# Altium project 175-00036, rev1, Super Sniffer.PrjPCB
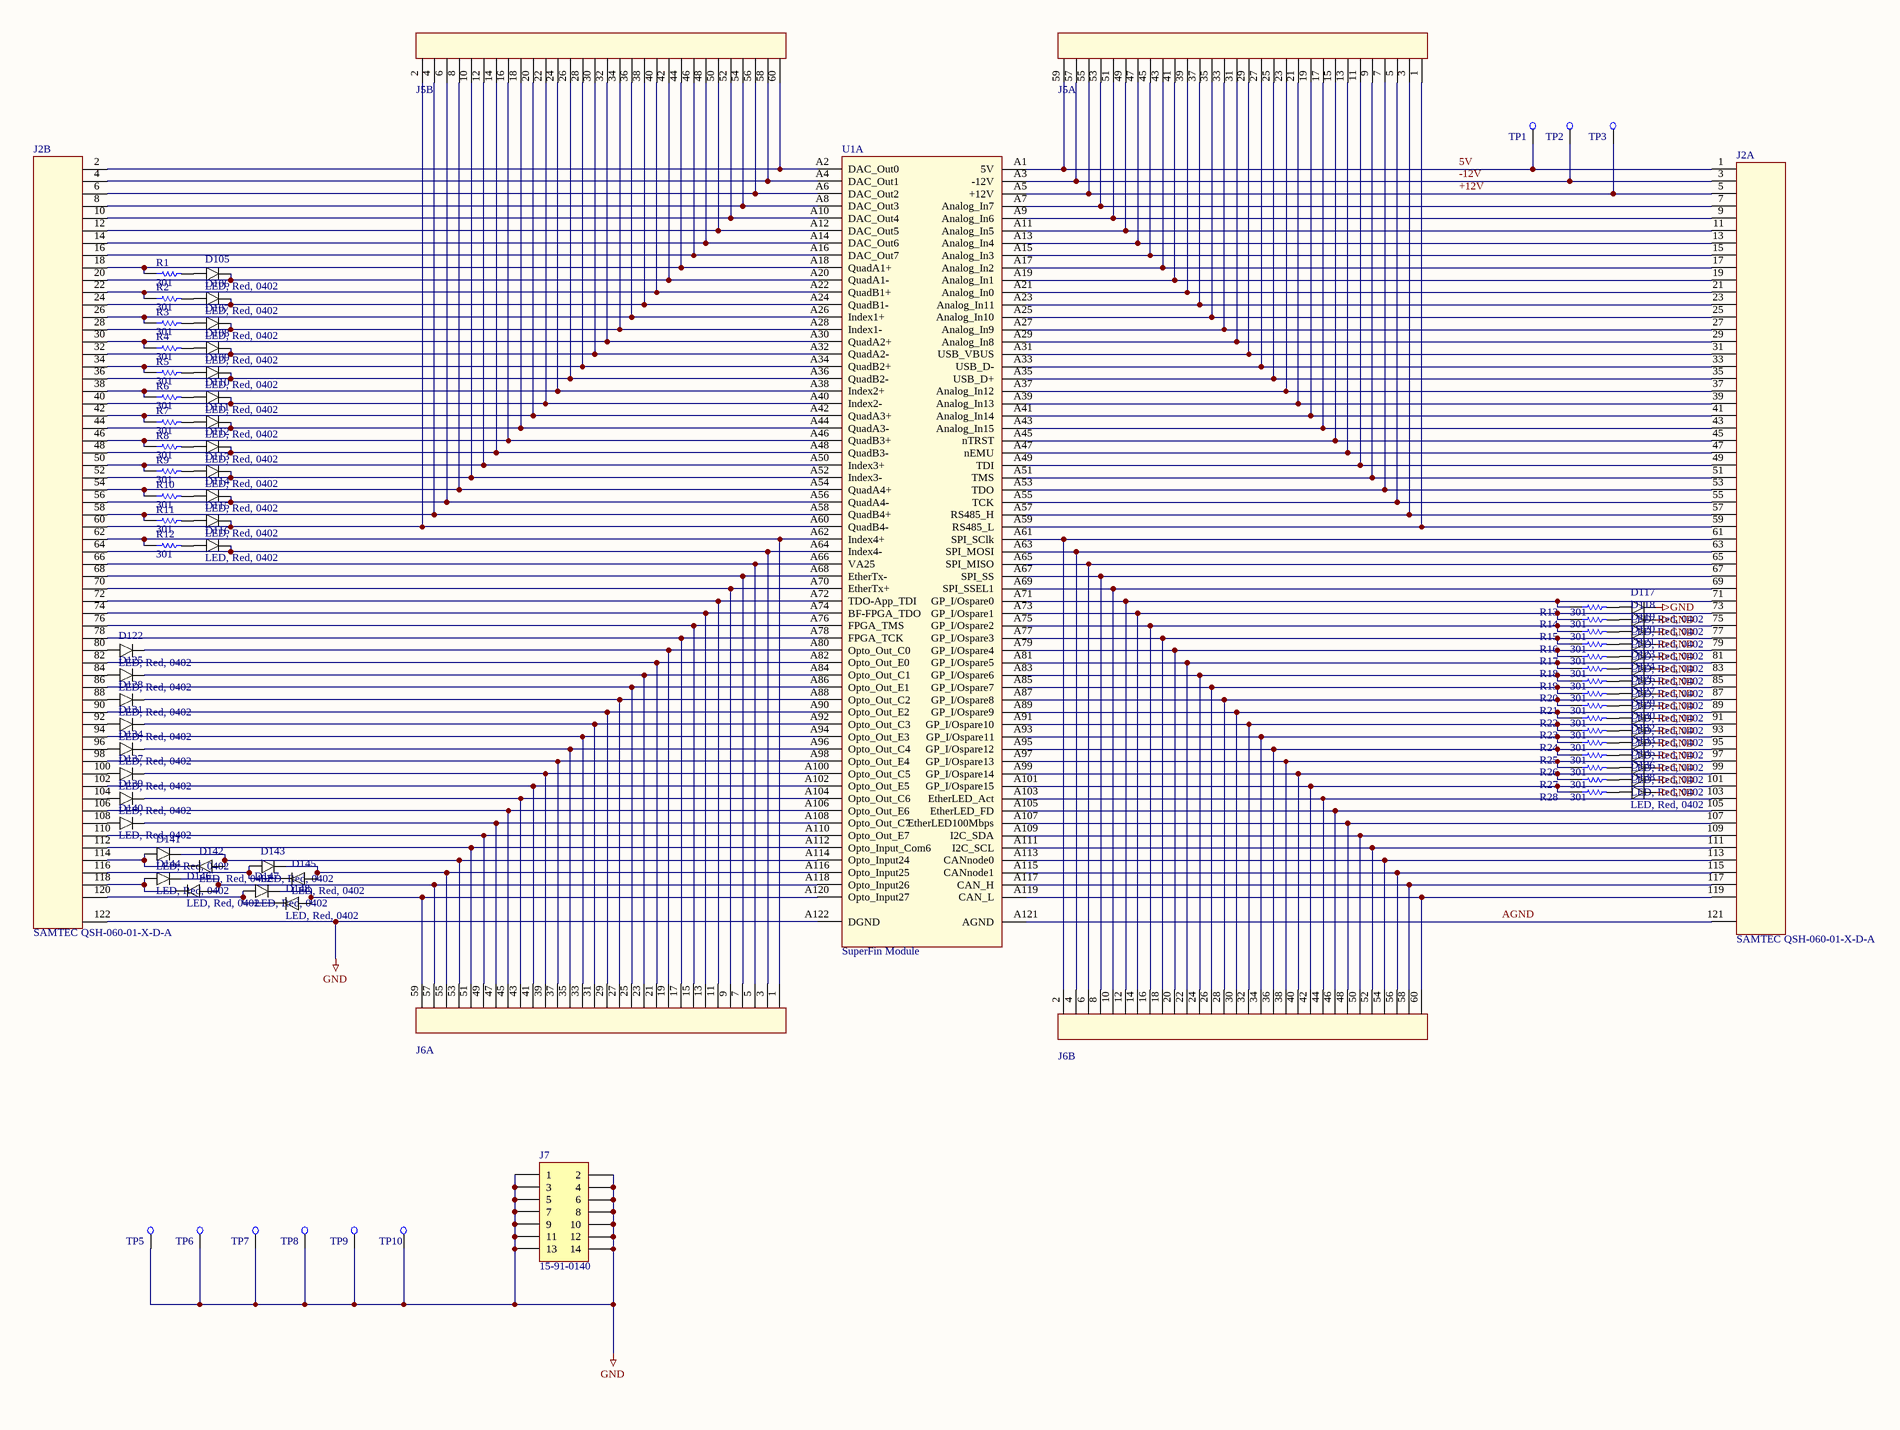
[diagram p0: 780-00040, Rev1, Pg1, Super Sniffer.SchDoc, left]
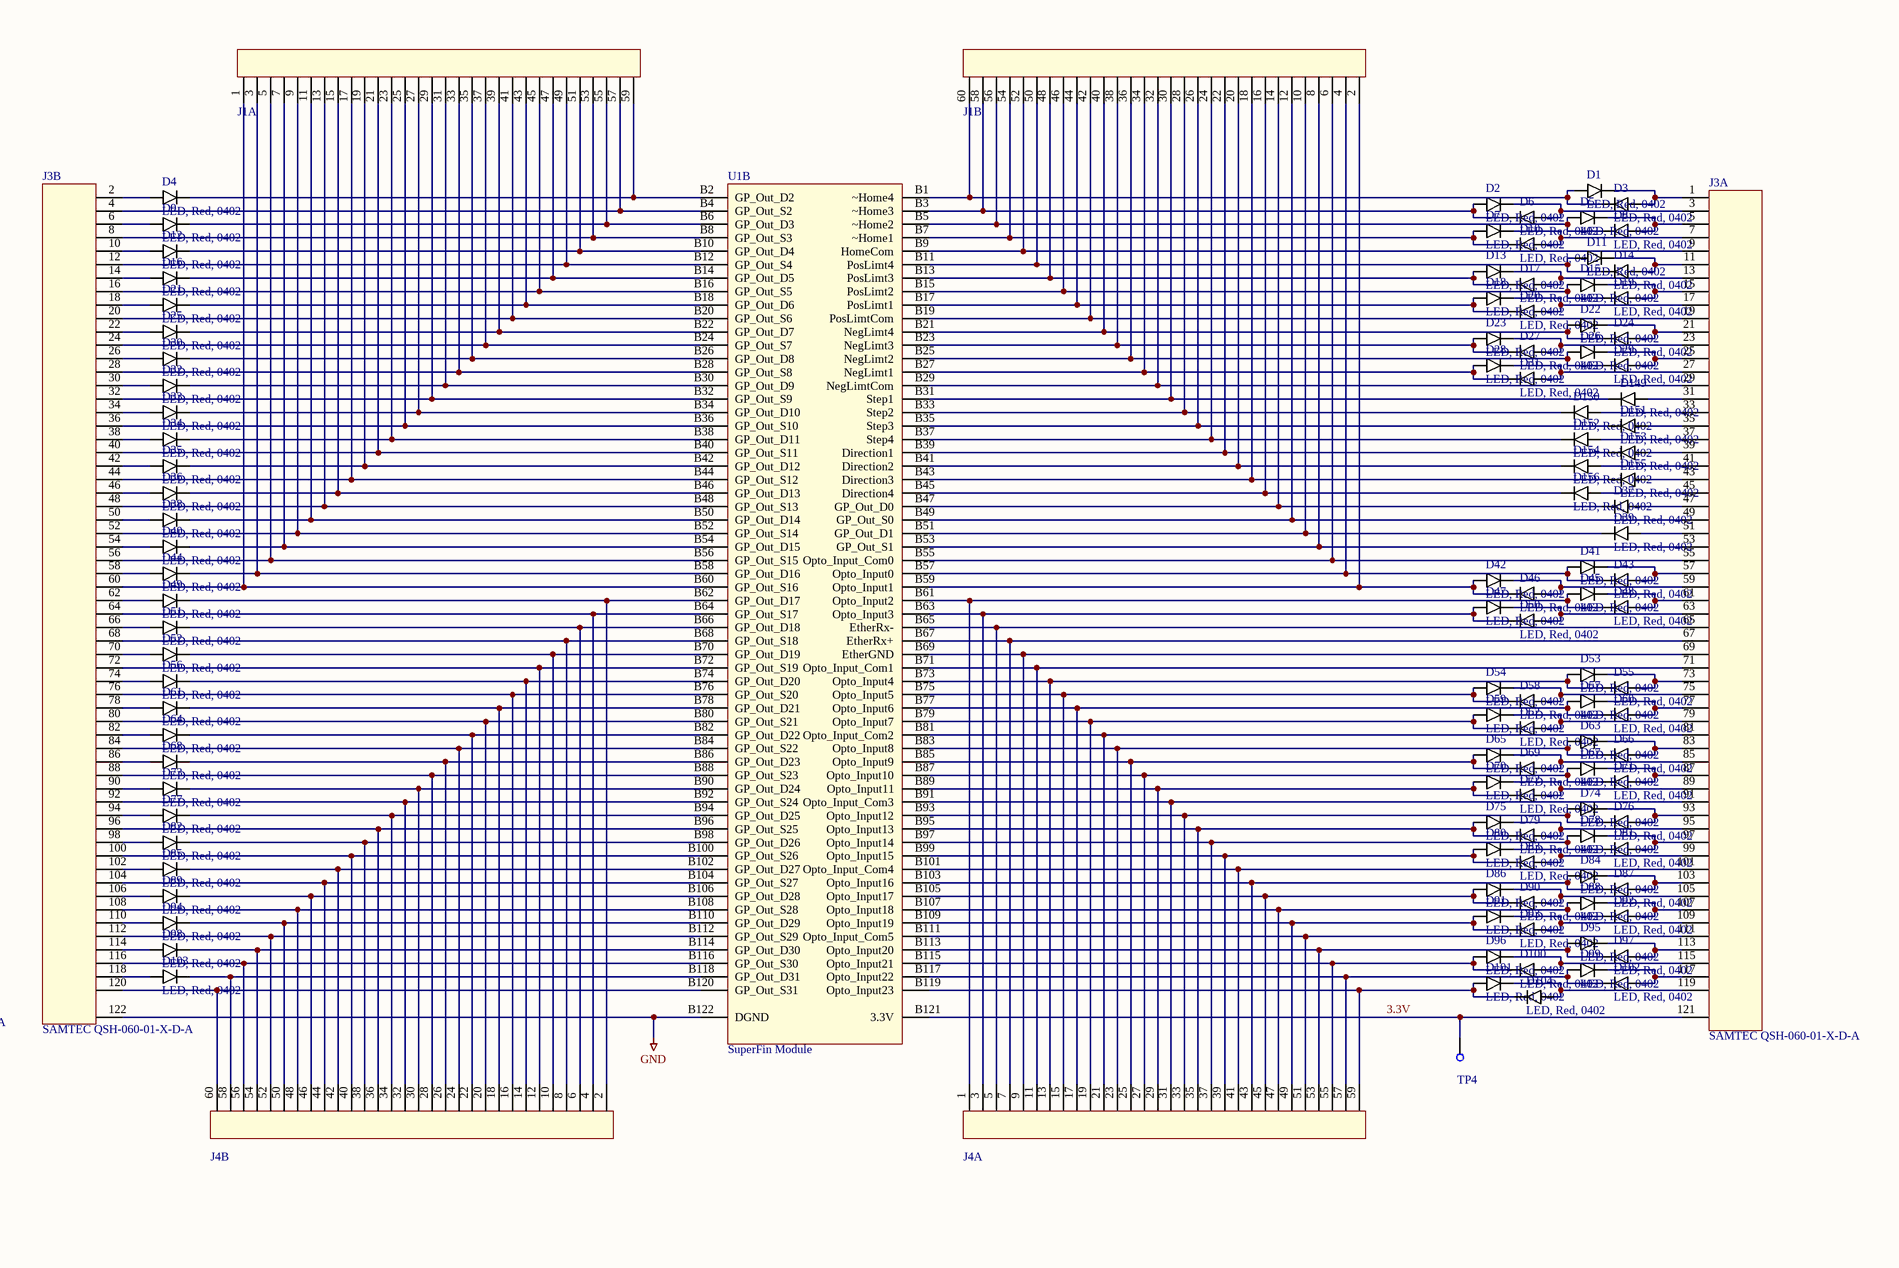
[diagram p1: 780-00040, Rev1, Pg1, Super Sniffer.SchDoc, right]
2 sheets, 209 parts. Net scope: global (net labels, ports and power ports of the same name join across sheets).
Board file: 175-00036, rev1, Super Sniffer.PcbDoc
Sheets:
  780-00040, Rev1, Pg1, Super Sniffer.SchDoc
  Sheet1.SchDoc

## Sheet 780-00040, Rev1, Pg1, Super Sniffer.SchDoc
size D; PageSetup: Record=PageOptions|CenterHorizontal=True|CenterVertical=True|PrintScale=0.51|XCorrection=1.00|YCorrection=1.00|PrintKind=0|BorderSize=5000000|LeftOffset=0|BottomOffset=0|Orientation=2|PaperLength=1000|PaperWidth=1000|Scale=100|PaperSource=7|PrintQuality=-4|MediaType=1|DitherType=10|PaperKind=Tabloid 11 x 17in|PrintScaleMode=1

### Parts
D1  value LED, Red, 0402  [LED SMD 0402]  (hidden comment: LED SMD 0402)
D2  value LED, Red, 0402  [LED SMD 0402]  (hidden comment: LED SMD 0402)
D3  value LED, Red, 0402  [LED SMD 0402]  (hidden comment: LED SMD 0402)
D4  value LED, Red, 0402  [LED SMD 0402]  (hidden comment: LED SMD 0402)
D5  value LED, Red, 0402  [LED SMD 0402]  (hidden comment: LED SMD 0402)
D6  value LED, Red, 0402  [LED SMD 0402]  (hidden comment: LED SMD 0402)
D7  value LED, Red, 0402  [LED SMD 0402]  (hidden comment: LED SMD 0402)
D8  value LED, Red, 0402  [LED SMD 0402]  (hidden comment: LED SMD 0402)
D9  value LED, Red, 0402  [LED SMD 0402]  (hidden comment: LED SMD 0402)
D10  value LED, Red, 0402  [LED SMD 0402]  (hidden comment: LED SMD 0402)
D11  value LED, Red, 0402  [LED SMD 0402]  (hidden comment: LED SMD 0402)
D12  value LED, Red, 0402  [LED SMD 0402]  (hidden comment: LED SMD 0402)
D13  value LED, Red, 0402  [LED SMD 0402]  (hidden comment: LED SMD 0402)
D14  value LED, Red, 0402  [LED SMD 0402]  (hidden comment: LED SMD 0402)
D15  value LED, Red, 0402  [LED SMD 0402]  (hidden comment: LED SMD 0402)
D16  value LED, Red, 0402  [LED SMD 0402]  (hidden comment: LED SMD 0402)
D17  value LED, Red, 0402  [LED SMD 0402]  (hidden comment: LED SMD 0402)
D18  value LED, Red, 0402  [LED SMD 0402]  (hidden comment: LED SMD 0402)
D19  value LED, Red, 0402  [LED SMD 0402]  (hidden comment: LED SMD 0402)
D20  value LED, Red, 0402  [LED SMD 0402]  (hidden comment: LED SMD 0402)
D21  value LED, Red, 0402  [LED SMD 0402]  (hidden comment: LED SMD 0402)
D22  value LED, Red, 0402  [LED SMD 0402]  (hidden comment: LED SMD 0402)
D23  value LED, Red, 0402  [LED SMD 0402]  (hidden comment: LED SMD 0402)
D24  value LED, Red, 0402  [LED SMD 0402]  (hidden comment: LED SMD 0402)
D25  value LED, Red, 0402  [LED SMD 0402]  (hidden comment: LED SMD 0402)
D26  value LED, Red, 0402  [LED SMD 0402]  (hidden comment: LED SMD 0402)
D27  value LED, Red, 0402  [LED SMD 0402]  (hidden comment: LED SMD 0402)
D28  value LED, Red, 0402  [LED SMD 0402]  (hidden comment: LED SMD 0402)
D29  value LED, Red, 0402  [LED SMD 0402]  (hidden comment: LED SMD 0402)
D30  value LED, Red, 0402  [LED SMD 0402]  (hidden comment: LED SMD 0402)
D31  value LED, Red, 0402  [LED SMD 0402]  (hidden comment: LED SMD 0402)
D32  value LED, Red, 0402  [LED SMD 0402]  (hidden comment: LED SMD 0402)
D33  value LED, Red, 0402  [LED SMD 0402]  (hidden comment: LED SMD 0402)
D34  value LED, Red, 0402  [LED SMD 0402]  (hidden comment: LED SMD 0402)
D35  value LED, Red, 0402  [LED SMD 0402]  (hidden comment: LED SMD 0402)
D36  value LED, Red, 0402  [LED SMD 0402]  (hidden comment: LED SMD 0402)
D37  value LED, Red, 0402  [LED SMD 0402]  (hidden comment: LED SMD 0402)
D38  value LED, Red, 0402  [LED SMD 0402]  (hidden comment: LED SMD 0402)
D39  value LED, Red, 0402  [LED SMD 0402]  (hidden comment: LED SMD 0402)
D40  value LED, Red, 0402  [LED SMD 0402]  (hidden comment: LED SMD 0402)
D41  value LED, Red, 0402  [LED SMD 0402]  (hidden comment: LED SMD 0402)
D42  value LED, Red, 0402  [LED SMD 0402]  (hidden comment: LED SMD 0402)
D43  value LED, Red, 0402  [LED SMD 0402]  (hidden comment: LED SMD 0402)
D44  value LED, Red, 0402  [LED SMD 0402]  (hidden comment: LED SMD 0402)
D45  value LED, Red, 0402  [LED SMD 0402]  (hidden comment: LED SMD 0402)
D46  value LED, Red, 0402  [LED SMD 0402]  (hidden comment: LED SMD 0402)
D47  value LED, Red, 0402  [LED SMD 0402]  (hidden comment: LED SMD 0402)
D48  value LED, Red, 0402  [LED SMD 0402]  (hidden comment: LED SMD 0402)
D49  value LED, Red, 0402  [LED SMD 0402]  (hidden comment: LED SMD 0402)
D50  value LED, Red, 0402  [LED SMD 0402]  (hidden comment: LED SMD 0402)
D51  value LED, Red, 0402  [LED SMD 0402]  (hidden comment: LED SMD 0402)
D52  value LED, Red, 0402  [LED SMD 0402]  (hidden comment: LED SMD 0402)
D53  value LED, Red, 0402  [LED SMD 0402]  (hidden comment: LED SMD 0402)
D54  value LED, Red, 0402  [LED SMD 0402]  (hidden comment: LED SMD 0402)
D55  value LED, Red, 0402  [LED SMD 0402]  (hidden comment: LED SMD 0402)
D56  value LED, Red, 0402  [LED SMD 0402]  (hidden comment: LED SMD 0402)
D57  value LED, Red, 0402  [LED SMD 0402]  (hidden comment: LED SMD 0402)
D58  value LED, Red, 0402  [LED SMD 0402]  (hidden comment: LED SMD 0402)
D59  value LED, Red, 0402  [LED SMD 0402]  (hidden comment: LED SMD 0402)
D60  value LED, Red, 0402  [LED SMD 0402]  (hidden comment: LED SMD 0402)
D61  value LED, Red, 0402  [LED SMD 0402]  (hidden comment: LED SMD 0402)
D62  value LED, Red, 0402  [LED SMD 0402]  (hidden comment: LED SMD 0402)
D63  value LED, Red, 0402  [LED SMD 0402]  (hidden comment: LED SMD 0402)
D64  value LED, Red, 0402  [LED SMD 0402]  (hidden comment: LED SMD 0402)
D65  value LED, Red, 0402  [LED SMD 0402]  (hidden comment: LED SMD 0402)
D66  value LED, Red, 0402  [LED SMD 0402]  (hidden comment: LED SMD 0402)
D67  value LED, Red, 0402  [LED SMD 0402]  (hidden comment: LED SMD 0402)
D68  value LED, Red, 0402  [LED SMD 0402]  (hidden comment: LED SMD 0402)
D69  value LED, Red, 0402  [LED SMD 0402]  (hidden comment: LED SMD 0402)
D70  value LED, Red, 0402  [LED SMD 0402]  (hidden comment: LED SMD 0402)
D71  value LED, Red, 0402  [LED SMD 0402]  (hidden comment: LED SMD 0402)
D72  value LED, Red, 0402  [LED SMD 0402]  (hidden comment: LED SMD 0402)
D73  value LED, Red, 0402  [LED SMD 0402]  (hidden comment: LED SMD 0402)
D74  value LED, Red, 0402  [LED SMD 0402]  (hidden comment: LED SMD 0402)
D75  value LED, Red, 0402  [LED SMD 0402]  (hidden comment: LED SMD 0402)
D76  value LED, Red, 0402  [LED SMD 0402]  (hidden comment: LED SMD 0402)
D77  value LED, Red, 0402  [LED SMD 0402]  (hidden comment: LED SMD 0402)
D78  value LED, Red, 0402  [LED SMD 0402]  (hidden comment: LED SMD 0402)
D79  value LED, Red, 0402  [LED SMD 0402]  (hidden comment: LED SMD 0402)
D80  value LED, Red, 0402  [LED SMD 0402]  (hidden comment: LED SMD 0402)
D81  value LED, Red, 0402  [LED SMD 0402]  (hidden comment: LED SMD 0402)
D82  value LED, Red, 0402  [LED SMD 0402]  (hidden comment: LED SMD 0402)
D83  value LED, Red, 0402  [LED SMD 0402]  (hidden comment: LED SMD 0402)
D84  value LED, Red, 0402  [LED SMD 0402]  (hidden comment: LED SMD 0402)
D85  value LED, Red, 0402  [LED SMD 0402]  (hidden comment: LED SMD 0402)
D86  value LED, Red, 0402  [LED SMD 0402]  (hidden comment: LED SMD 0402)
D87  value LED, Red, 0402  [LED SMD 0402]  (hidden comment: LED SMD 0402)
D88  value LED, Red, 0402  [LED SMD 0402]  (hidden comment: LED SMD 0402)
D89  value LED, Red, 0402  [LED SMD 0402]  (hidden comment: LED SMD 0402)
D90  value LED, Red, 0402  [LED SMD 0402]  (hidden comment: LED SMD 0402)
D91  value LED, Red, 0402  [LED SMD 0402]  (hidden comment: LED SMD 0402)
D92  value LED, Red, 0402  [LED SMD 0402]  (hidden comment: LED SMD 0402)
D93  value LED, Red, 0402  [LED SMD 0402]  (hidden comment: LED SMD 0402)
D94  value LED, Red, 0402  [LED SMD 0402]  (hidden comment: LED SMD 0402)
D95  value LED, Red, 0402  [LED SMD 0402]  (hidden comment: LED SMD 0402)
D96  value LED, Red, 0402  [LED SMD 0402]  (hidden comment: LED SMD 0402)
D97  value LED, Red, 0402  [LED SMD 0402]  (hidden comment: LED SMD 0402)
D98  value LED, Red, 0402  [LED SMD 0402]  (hidden comment: LED SMD 0402)
D99  value LED, Red, 0402  [LED SMD 0402]  (hidden comment: LED SMD 0402)
D100  value LED, Red, 0402  [LED SMD 0402]  (hidden comment: LED SMD 0402)
D101  value LED, Red, 0402  [LED SMD 0402]  (hidden comment: LED SMD 0402)
D102  value LED, Red, 0402  [LED SMD 0402]  (hidden comment: LED SMD 0402)
D103  value LED, Red, 0402  [LED SMD 0402]  (hidden comment: LED SMD 0402)
D104  value LED, Red, 0402  [LED SMD 0402]  (hidden comment: LED SMD 0402)
D105  value LED, Red, 0402  [LED SMD 0402]  (hidden comment: LED SMD 0402)
D106  value LED, Red, 0402  [LED SMD 0402]  (hidden comment: LED SMD 0402)
D107  value LED, Red, 0402  [LED SMD 0402]  (hidden comment: LED SMD 0402)
D108  value LED, Red, 0402  [LED SMD 0402]  (hidden comment: LED SMD 0402)
D109  value LED, Red, 0402  [LED SMD 0402]  (hidden comment: LED SMD 0402)
D110  value LED, Red, 0402  [LED SMD 0402]  (hidden comment: LED SMD 0402)
D111  value LED, Red, 0402  [LED SMD 0402]  (hidden comment: LED SMD 0402)
D112  value LED, Red, 0402  [LED SMD 0402]  (hidden comment: LED SMD 0402)
D113  value LED, Red, 0402  [LED SMD 0402]  (hidden comment: LED SMD 0402)
D114  value LED, Red, 0402  [LED SMD 0402]  (hidden comment: LED SMD 0402)
D115  value LED, Red, 0402  [LED SMD 0402]  (hidden comment: LED SMD 0402)
D116  value LED, Red, 0402  [LED SMD 0402]  (hidden comment: LED SMD 0402)
D117  value LED, Red, 0402  [LED SMD 0402]  (hidden comment: LED SMD 0402)
D118  value LED, Red, 0402  [LED SMD 0402]  (hidden comment: LED SMD 0402)
D119  value LED, Red, 0402  [LED SMD 0402]  (hidden comment: LED SMD 0402)
D120  value LED, Red, 0402  [LED SMD 0402]  (hidden comment: LED SMD 0402)
D121  value LED, Red, 0402  [LED SMD 0402]  (hidden comment: LED SMD 0402)
D122  value LED, Red, 0402  [LED SMD 0402]  (hidden comment: LED SMD 0402)
D123  value LED, Red, 0402  [LED SMD 0402]  (hidden comment: LED SMD 0402)
D124  value LED, Red, 0402  [LED SMD 0402]  (hidden comment: LED SMD 0402)
D125  value LED, Red, 0402  [LED SMD 0402]  (hidden comment: LED SMD 0402)
D126  value LED, Red, 0402  [LED SMD 0402]  (hidden comment: LED SMD 0402)
D127  value LED, Red, 0402  [LED SMD 0402]  (hidden comment: LED SMD 0402)
D128  value LED, Red, 0402  [LED SMD 0402]  (hidden comment: LED SMD 0402)
D129  value LED, Red, 0402  [LED SMD 0402]  (hidden comment: LED SMD 0402)
D130  value LED, Red, 0402  [LED SMD 0402]  (hidden comment: LED SMD 0402)
D131  value LED, Red, 0402  [LED SMD 0402]  (hidden comment: LED SMD 0402)
D132  value LED, Red, 0402  [LED SMD 0402]  (hidden comment: LED SMD 0402)
D133  value LED, Red, 0402  [LED SMD 0402]  (hidden comment: LED SMD 0402)
D134  value LED, Red, 0402  [LED SMD 0402]  (hidden comment: LED SMD 0402)
D135  value LED, Red, 0402  [LED SMD 0402]  (hidden comment: LED SMD 0402)
D136  value LED, Red, 0402  [LED SMD 0402]  (hidden comment: LED SMD 0402)
D137  value LED, Red, 0402  [LED SMD 0402]  (hidden comment: LED SMD 0402)
D138  value LED, Red, 0402  [LED SMD 0402]  (hidden comment: LED SMD 0402)
D139  value LED, Red, 0402  [LED SMD 0402]  (hidden comment: LED SMD 0402)
D140  value LED, Red, 0402  [LED SMD 0402]  (hidden comment: LED SMD 0402)
D141  value LED, Red, 0402  [LED SMD 0402]  (hidden comment: LED SMD 0402)
D142  value LED, Red, 0402  [LED SMD 0402]  (hidden comment: LED SMD 0402)
D143  value LED, Red, 0402  [LED SMD 0402]  (hidden comment: LED SMD 0402)
D144  value LED, Red, 0402  [LED SMD 0402]  (hidden comment: LED SMD 0402)
D145  value LED, Red, 0402  [LED SMD 0402]  (hidden comment: LED SMD 0402)
D146  value LED, Red, 0402  [LED SMD 0402]  (hidden comment: LED SMD 0402)
D147  value LED, Red, 0402  [LED SMD 0402]  (hidden comment: LED SMD 0402)
D148  value LED, Red, 0402  [LED SMD 0402]  (hidden comment: LED SMD 0402)
D149  value LED, Red, 0402  [LED SMD 0402]  (hidden comment: LED SMD 0402)
D150  value LED, Red, 0402  [LED SMD 0402]  (hidden comment: LED SMD 0402)
D151  value LED, Red, 0402  [LED SMD 0402]  (hidden comment: LED SMD 0402)
D152  value LED, Red, 0402  [LED SMD 0402]  (hidden comment: LED SMD 0402)
D153  value LED, Red, 0402  [LED SMD 0402]  (hidden comment: LED SMD 0402)
D154  value LED, Red, 0402  [LED SMD 0402]  (hidden comment: LED SMD 0402)
D155  value LED, Red, 0402  [LED SMD 0402]  (hidden comment: LED SMD 0402)
D156  value LED, Red, 0402  [LED SMD 0402]  (hidden comment: LED SMD 0402)
J1  HDR 2x30   0.1"  [HEADER 2X30]  (value not drawn)  (parts A,B of 2)
J2  SAMTEC QSH-060-01-X-D-A  [QSH-060-010-X-D-A]  (parts A,B of 2)
J3  SAMTEC QSH-060-01-X-D-A  [QSH-060-010-X-D-A]  (parts A,B of 2)
J4  HDR 2x30   0.1"  [HEADER 2X30]  (value not drawn)  (parts A,B of 2)
J5  HDR 2x30   0.1"  [HEADER 2X30]  (value not drawn)  (parts A,B of 2)
J6  HDR 2x30   0.1"  [HEADER 2X30]  (value not drawn)  (parts A,B of 2)
J7  15-91-0140  [HDR2X7]
R1  value 301  [SMD_0805]  (hidden comment: Res 0805)
R2  value 301  [SMD_0805]  (hidden comment: Res 0805)
R3  value 301  [SMD_0805]  (hidden comment: Res 0805)
R4  value 301  [SMD_0805]  (hidden comment: Res 0805)
R5  value 301  [SMD_0805]  (hidden comment: Res 0805)
R6  value 301  [SMD_0805]  (hidden comment: Res 0805)
R7  value 301  [SMD_0805]  (hidden comment: Res 0805)
R8  value 301  [SMD_0805]  (hidden comment: Res 0805)
R9  value 301  [SMD_0805]  (hidden comment: Res 0805)
R10  value 301  [SMD_0805]  (hidden comment: Res 0805)
R11  value 301  [SMD_0805]  (hidden comment: Res 0805)
R12  value 301  [SMD_0805]  (hidden comment: Res 0805)
R13  value 301  [SMD_0805]  (hidden comment: Res 0805)
R14  value 301  [SMD_0805]  (hidden comment: Res 0805)
R15  value 301  [SMD_0805]  (hidden comment: Res 0805)
R16  value 301  [SMD_0805]  (hidden comment: Res 0805)
R17  value 301  [SMD_0805]  (hidden comment: Res 0805)
R18  value 301  [SMD_0805]  (hidden comment: Res 0805)
R19  value 301  [SMD_0805]  (hidden comment: Res 0805)
R20  value 301  [SMD_0805]  (hidden comment: Res 0805)
R21  value 301  [SMD_0805]  (hidden comment: Res 0805)
R22  value 301  [SMD_0805]  (hidden comment: Res 0805)
R23  value 301  [SMD_0805]  (hidden comment: Res 0805)
R24  value 301  [SMD_0805]  (hidden comment: Res 0805)
R25  value 301  [SMD_0805]  (hidden comment: Res 0805)
R26  value 301  [SMD_0805]  (hidden comment: Res 0805)
R27  value 301  [SMD_0805]  (hidden comment: Res 0805)
R28  value 301  [SMD_0805]  (hidden comment: Res 0805)
TP1  Test point  [PAD_80D_052H]  (value not drawn)
TP2  Test point  [PAD_80D_052H]  (value not drawn)
TP3  Test point  [PAD_80D_052H]  (value not drawn)
TP4  Test point  [PAD_80D_052H]  (value not drawn)
TP5  Test point  [PAD_80D_052H]  (value not drawn)
TP6  Test point  [PAD_80D_052H]  (value not drawn)
TP7  Test point  [PAD_80D_052H]  (value not drawn)
TP8  Test point  [PAD_80D_052H]  (value not drawn)
TP9  Test point  [PAD_80D_052H]  (value not drawn)
TP10  Test point  [PAD_80D_052H]  (value not drawn)
U1  SuperFin Module  [SuperFin Footprint]  (parts A,B of 2)

### Nets
GND: D117.1(Cathode) D118.1(Cathode) D119.1(Cathode) D120.1(Cathode) D121.1(Cathode) D123.1(Cathode) D124.1(Cathode) D126.1(Cathode) D127.1(Cathode) D129.1(Cathode) D130.1(Cathode) D132.1(Cathode) D133.1(Cathode) D135.1(Cathode) D136.1(Cathode) D138.1(Cathode) J2.122 J3.122 J7.1 J7.2 J7.3 J7.4 J7.5 J7.6 J7.7 J7.8 J7.9 J7.10 J7.11 J7.12 J7.13 J7.14 TP5.1(TP) TP6.1(TP) TP7.1(TP) TP8.1(TP) TP9.1(TP) TP10.1(TP) U1.A122(DGND) U1.B122(DGND)
3.3V: J3.121 TP4.1(TP) U1.B121(3.3V)
5V: J2.1(GND) J5.59 TP1.1(TP) U1.A1(5V)
+12V: J2.5 J5.55 TP3.1(TP) U1.A5(+12V)
-12V: J2.3 J5.57 TP2.1(TP) U1.A3(-12V)
AGND: J2.121 U1.A121(AGND)
NetD1_1: D1.1(Cathode) D3.2(Anode) J3.1(GND)
NetD1_2: D1.2(Anode) D3.1(Cathode) J1.60 U1.B1(~Home4)
NetD2_1: D2.1(Cathode) D6.2(Anode) J3.3
NetD2_2: D2.2(Anode) D6.1(Cathode) J1.58 U1.B3(~Home3)
NetD4_1: D4.1(Cathode) J1.59 U1.B2(GP_Out_D2)
NetD4_2: D4.2(Anode) J3.2
NetD5_1: D5.1(Cathode) D8.2(Anode) J3.5
NetD5_2: D5.2(Anode) D8.1(Cathode) J1.56 U1.B5(~Home2)
NetD7_1: D7.1(Cathode) D10.2(Anode) J3.7
NetD7_2: D7.2(Anode) D10.1(Cathode) J1.54 U1.B7(~Home1)
NetD9_1: D9.1(Cathode) J1.55 U1.B6(GP_Out_D3)
NetD9_2: D9.2(Anode) J3.6
NetD11_1: D11.1(Cathode) D14.2(Anode) J3.11
NetD11_2: D11.2(Anode) D14.1(Cathode) J1.50 U1.B11(PosLimt4)
NetD12_1: D12.1(Cathode) J1.51 U1.B10(GP_Out_D4)
NetD12_2: D12.2(Anode) J3.10
NetD13_1: D13.1(Cathode) D17.2(Anode) J3.13
NetD13_2: D13.2(Anode) D17.1(Cathode) J1.48 U1.B13(PosLimt3)
NetD15_1: D15.1(Cathode) D19.2(Anode) J3.15
NetD15_2: D15.2(Anode) D19.1(Cathode) J1.46 U1.B15(PosLimt2)
NetD16_1: D16.1(Cathode) J1.47 U1.B14(GP_Out_D5)
NetD16_2: D16.2(Anode) J3.14
NetD18_1: D18.1(Cathode) D20.2(Anode) J3.17
NetD18_2: D18.2(Anode) D20.1(Cathode) J1.44 U1.B17(PosLimt1)
NetD21_1: D21.1(Cathode) J1.43 U1.B18(GP_Out_D6)
NetD21_2: D21.2(Anode) J3.18
NetD22_1: D22.1(Cathode) D24.2(Anode) J3.21
NetD22_2: D22.2(Anode) D24.1(Cathode) J1.40 U1.B21(NegLimt4)
NetD23_1: D23.1(Cathode) D27.2(Anode) J3.23
NetD23_2: D23.2(Anode) D27.1(Cathode) J1.38 U1.B23(NegLimt3)
NetD25_1: D25.1(Cathode) J1.39 U1.B22(GP_Out_D7)
NetD25_2: D25.2(Anode) J3.22
NetD26_1: D26.1(Cathode) D29.2(Anode) J3.25
NetD26_2: D26.2(Anode) D29.1(Cathode) J1.36 U1.B25(NegLimt2)
NetD28_1: D28.1(Cathode) D31.2(Anode) J3.27
NetD28_2: D28.2(Anode) D31.1(Cathode) J1.34 U1.B27(NegLimt1)
NetD30_1: D30.1(Cathode) J1.35 U1.B26(GP_Out_D8)
NetD30_2: D30.2(Anode) J3.26
NetD32_1: D32.1(Cathode) J1.31 U1.B30(GP_Out_D9)
NetD32_2: D32.2(Anode) J3.30
NetD33_1: D33.1(Cathode) J1.27 U1.B34(GP_Out_D10)
NetD33_2: D33.2(Anode) J3.34
NetD34_1: D34.1(Cathode) J1.23 U1.B38(GP_Out_D11)
NetD34_2: D34.2(Anode) J3.38
NetD35_1: D35.1(Cathode) J1.19 U1.B42(GP_Out_D12)
NetD35_2: D35.2(Anode) J3.42
NetD36_1: D36.1(Cathode) J1.15 U1.B46(GP_Out_D13)
NetD36_2: D36.2(Anode) J3.46
NetD37_1: D37.1(Cathode) J1.14 U1.B47(GP_Out_D0)
NetD37_2: D37.2(Anode) J3.47
NetD38_1: D38.1(Cathode) J1.11 U1.B50(GP_Out_D14)
NetD38_2: D38.2(Anode) J3.50
NetD39_1: D39.1(Cathode) J1.10 U1.B51(GP_Out_D1)
NetD39_2: D39.2(Anode) J3.51
NetD40_1: D40.1(Cathode) J1.7 U1.B54(GP_Out_D15)
NetD40_2: D40.2(Anode) J3.54
NetD41_1: D41.1(Cathode) D43.2(Anode) J3.57
NetD41_2: D41.2(Anode) D43.1(Cathode) J1.4 U1.B57(Opto_Input0)
NetD42_1: D42.1(Cathode) D46.2(Anode) J3.59
NetD42_2: D42.2(Anode) D46.1(Cathode) J1.2 U1.B59(Opto_Input1)
NetD44_1: D44.1(Cathode) J1.3 U1.B58(GP_Out_D16)
NetD44_2: D44.2(Anode) J3.58
NetD45_1: D45.1(Cathode) D48.2(Anode) J3.61
NetD45_2: D45.2(Anode) D48.1(Cathode) J4.1 U1.B61(Opto_Input2)
NetD47_1: D47.1(Cathode) D50.2(Anode) J3.63
NetD47_2: D47.2(Anode) D50.1(Cathode) J4.3 U1.B63(Opto_Input3)
NetD49_1: D49.1(Cathode) J4.2 U1.B62(GP_Out_D17)
NetD49_2: D49.2(Anode) J3.62
NetD51_1: D51.1(Cathode) J4.6 U1.B66(GP_Out_D18)
NetD51_2: D51.2(Anode) J3.66
NetD52_1: D52.1(Cathode) J4.10 U1.B70(GP_Out_D19)
NetD52_2: D52.2(Anode) J3.70
NetD53_1: D53.1(Cathode) D55.2(Anode) J3.73
NetD53_2: D53.2(Anode) D55.1(Cathode) J4.13 U1.B73(Opto_Input4)
NetD54_1: D54.1(Cathode) D58.2(Anode) J3.75
NetD54_2: D54.2(Anode) D58.1(Cathode) J4.15 U1.B75(Opto_Input5)
NetD56_1: D56.1(Cathode) J4.14 U1.B74(GP_Out_D20)
NetD56_2: D56.2(Anode) J3.74
NetD57_1: D57.1(Cathode) D60.2(Anode) J3.77
NetD57_2: D57.2(Anode) D60.1(Cathode) J4.17 U1.B77(Opto_Input6)
NetD59_1: D59.1(Cathode) D62.2(Anode) J3.79
NetD59_2: D59.2(Anode) D62.1(Cathode) J4.19 U1.B79(Opto_Input7)
NetD61_1: D61.1(Cathode) J4.18 U1.B78(GP_Out_D21)
NetD61_2: D61.2(Anode) J3.78
NetD63_1: D63.1(Cathode) D66.2(Anode) J3.83
NetD63_2: D63.2(Anode) D66.1(Cathode) J4.23 U1.B83(Opto_Input8)
NetD64_1: D64.1(Cathode) J4.22 U1.B82(GP_Out_D22)
NetD64_2: D64.2(Anode) J3.82
NetD65_1: D65.1(Cathode) D69.2(Anode) J3.85
NetD65_2: D65.2(Anode) D69.1(Cathode) J4.25 U1.B85(Opto_Input9)
NetD67_1: D67.1(Cathode) D71.2(Anode) J3.87
NetD67_2: D67.2(Anode) D71.1(Cathode) J4.27 U1.B87(Opto_Input10)
NetD68_1: D68.1(Cathode) J4.26 U1.B86(GP_Out_D23)
NetD68_2: D68.2(Anode) J3.86
NetD70_1: D70.1(Cathode) D72.2(Anode) J3.89
NetD70_2: D70.2(Anode) D72.1(Cathode) J4.29 U1.B89(Opto_Input11)
NetD73_1: D73.1(Cathode) J4.30 U1.B90(GP_Out_D24)
NetD73_2: D73.2(Anode) J3.90
NetD74_1: D74.1(Cathode) D76.2(Anode) J3.93
NetD74_2: D74.2(Anode) D76.1(Cathode) J4.33 U1.B93(Opto_Input12)
NetD75_1: D75.1(Cathode) D79.2(Anode) J3.95
NetD75_2: D75.2(Anode) D79.1(Cathode) J4.35 U1.B95(Opto_Input13)
NetD77_1: D77.1(Cathode) J4.34 U1.B94(GP_Out_D25)
NetD77_2: D77.2(Anode) J3.94
NetD78_1: D78.1(Cathode) D81.2(Anode) J3.97
NetD78_2: D78.2(Anode) D81.1(Cathode) J4.37 U1.B97(Opto_Input14)
NetD80_1: D80.1(Cathode) D83.2(Anode) J3.99
NetD80_2: D80.2(Anode) D83.1(Cathode) J4.39 U1.B99(Opto_Input15)
NetD82_1: D82.1(Cathode) J4.38 U1.B98(GP_Out_D26)
NetD82_2: D82.2(Anode) J3.98
NetD84_1: D84.1(Cathode) D87.2(Anode) J3.103
NetD84_2: D84.2(Anode) D87.1(Cathode) J4.43 U1.B103(Opto_Input16)
NetD85_1: D85.1(Cathode) J4.42 U1.B102(GP_Out_D27)
NetD85_2: D85.2(Anode) J3.102
NetD86_1: D86.1(Cathode) D90.2(Anode) J3.105
NetD86_2: D86.2(Anode) D90.1(Cathode) J4.45 U1.B105(Opto_Input17)
NetD88_1: D88.1(Cathode) D92.2(Anode) J3.107
NetD88_2: D88.2(Anode) D92.1(Cathode) J4.47 U1.B107(Opto_Input18)
NetD89_1: D89.1(Cathode) J4.46 U1.B106(GP_Out_D28)
NetD89_2: D89.2(Anode) J3.106
NetD91_1: D91.1(Cathode) D93.2(Anode) J3.109
NetD91_2: D91.2(Anode) D93.1(Cathode) J4.49 U1.B109(Opto_Input19)
NetD94_1: D94.1(Cathode) J4.50 U1.B110(GP_Out_D29)
NetD94_2: D94.2(Anode) J3.110
NetD95_1: D95.1(Cathode) D97.2(Anode) J3.113
NetD95_2: D95.2(Anode) D97.1(Cathode) J4.53 U1.B113(Opto_Input20)
NetD96_1: D96.1(Cathode) D100.2(Anode) J3.115
NetD96_2: D96.2(Anode) D100.1(Cathode) J4.55 U1.B115(Opto_Input21)
NetD98_1: D98.1(Cathode) J4.54 U1.B114(GP_Out_D30)
NetD98_2: D98.2(Anode) J3.114
NetD99_1: D99.1(Cathode) D102.2(Anode) J3.117
NetD99_2: D99.2(Anode) D102.1(Cathode) J4.57 U1.B117(Opto_Input22)
NetD101_1: D101.1(Cathode) D104.2(Anode) J3.119
NetD101_2: D101.2(Anode) D104.1(Cathode) J4.59 U1.B119(Opto_Input23)
NetD103_1: D103.1(Cathode) J4.58 U1.B118(GP_Out_D31)
NetD103_2: D103.2(Anode) J3.118
NetD105_1: D105.1(Cathode) J2.20 J5.42 U1.A20(QuadA1-)
NetD105_2: D105.2(Anode) R1.2
NetD106_1: D106.1(Cathode) J2.24 J5.38 U1.A24(QuadB1-)
NetD106_2: D106.2(Anode) R2.2
NetD107_1: D107.1(Cathode) J2.28 J5.34 U1.A28(Index1-)
NetD107_2: D107.2(Anode) R3.2
NetD108_1: D108.1(Cathode) J2.32 J5.30 U1.A32(QuadA2-)
NetD108_2: D108.2(Anode) R4.2
NetD109_1: D109.1(Cathode) J2.36 J5.26 U1.A36(QuadB2-)
NetD109_2: D109.2(Anode) R5.2
NetD110_1: D110.1(Cathode) J2.40 J5.22 U1.A40(Index2-)
NetD110_2: D110.2(Anode) R6.2
NetD111_1: D111.1(Cathode) J2.44 J5.18 U1.A44(QuadA3-)
NetD111_2: D111.2(Anode) R7.2
NetD112_1: D112.1(Cathode) J2.48 J5.14 U1.A48(QuadB3-)
NetD112_2: D112.2(Anode) R8.2
NetD113_1: D113.1(Cathode) J2.52 J5.10 U1.A52(Index3-)
NetD113_2: D113.2(Anode) R9.2
NetD114_1: D114.1(Cathode) J2.56 J5.6 U1.A56(QuadA4-)
NetD114_2: D114.2(Anode) R10.2
NetD115_1: D115.1(Cathode) J2.60 J5.2 U1.A60(QuadB4-)
NetD115_2: D115.2(Anode) R11.2
NetD116_1: D116.1(Cathode) J2.64 J6.3 U1.A64(Index4-)
NetD116_2: D116.2(Anode) R12.2
NetD117_2: D117.2(Anode) R13.2
NetD118_2: D118.2(Anode) R14.2
NetD119_2: D119.2(Anode) R15.2
NetD120_2: D120.2(Anode) R16.2
NetD121_2: D121.2(Anode) R17.2
NetD122_1: D122.1(Cathode) J6.19 U1.A80(Opto_Out_C0)
NetD122_2: D122.2(Anode) J2.80
NetD123_2: D123.2(Anode) R18.2
NetD124_2: D124.2(Anode) R19.2
NetD125_1: D125.1(Cathode) J6.23 U1.A84(Opto_Out_C1)
NetD125_2: D125.2(Anode) J2.84
NetD126_2: D126.2(Anode) R20.2
NetD127_2: D127.2(Anode) R21.2
NetD128_1: D128.1(Cathode) J6.27 U1.A88(Opto_Out_C2)
NetD128_2: D128.2(Anode) J2.88
NetD129_2: D129.2(Anode) R22.2
NetD130_2: D130.2(Anode) R23.2
NetD131_1: D131.1(Cathode) J6.31 U1.A92(Opto_Out_C3)
NetD131_2: D131.2(Anode) J2.92
NetD132_2: D132.2(Anode) R24.2
NetD133_2: D133.2(Anode) R25.2
NetD134_1: D134.1(Cathode) J6.35 U1.A96(Opto_Out_C4)
NetD134_2: D134.2(Anode) J2.96
NetD135_2: D135.2(Anode) R26.2
NetD136_2: D136.2(Anode) R27.2
NetD137_1: D137.1(Cathode) J6.39 U1.A100(Opto_Out_C5)
NetD137_2: D137.2(Anode) J2.100
NetD138_2: D138.2(Anode) R28.2
NetD139_1: D139.1(Cathode) J6.43 U1.A104(Opto_Out_C6)
NetD139_2: D139.2(Anode) J2.104
NetD140_1: D140.1(Cathode) J6.47 U1.A108(Opto_Out_C7)
NetD140_2: D140.2(Anode) J2.108
NetD141_1: D141.1(Cathode) D142.2(Anode) J6.53 U1.A114(Opto_Input24)
NetD141_2: D141.2(Anode) D142.1(Cathode) J2.114
NetD143_1: D143.1(Cathode) D145.2(Anode) J6.55 U1.A116(Opto_Input25)
NetD143_2: D143.2(Anode) D145.1(Cathode) J2.116
NetD144_1: D144.1(Cathode) D146.2(Anode) J6.57 U1.A118(Opto_Input26)
NetD144_2: D144.2(Anode) D146.1(Cathode) J2.118
NetD147_1: D147.1(Cathode) D148.2(Anode) J6.59 U1.A120(Opto_Input27)
NetD147_2: D147.2(Anode) D148.1(Cathode) J2.120
NetD149_1: D149.1(Cathode) J1.30 U1.B31(Step1)
NetD149_2: D149.2(Anode) J3.31
NetD150_1: D150.1(Cathode) J1.28 U1.B33(Step2)
NetD150_2: D150.2(Anode) J3.33
NetD151_1: D151.1(Cathode) J1.26 U1.B35(Step3)
NetD151_2: D151.2(Anode) J3.35
NetD152_1: D152.1(Cathode) J1.24 U1.B37(Step4)
NetD152_2: D152.2(Anode) J3.37
NetD153_1: D153.1(Cathode) J1.22 U1.B39(Direction1)
NetD153_2: D153.2(Anode) J3.39
NetD154_1: D154.1(Cathode) J1.20 U1.B41(Direction2)
NetD154_2: D154.2(Anode) J3.41
NetD155_1: D155.1(Cathode) J1.18 U1.B43(Direction3)
NetD155_2: D155.2(Anode) J3.43
NetD156_1: D156.1(Cathode) J1.16 U1.B45(Direction4)
NetD156_2: D156.2(Anode) J3.45
NetJ1_1: J1.1 J3.60 U1.B60(GP_Out_S16)
NetJ1_5: J1.5 J3.56 U1.B56(GP_Out_S15)
NetJ1_6: J1.6 J3.55 U1.B55(Opto_Input_Com0)
NetJ1_8: J1.8 J3.53 U1.B53(GP_Out_S1)
NetJ1_9: J1.9 J3.52 U1.B52(GP_Out_S14)
NetJ1_12: J1.12 J3.49 U1.B49(GP_Out_S0)
NetJ1_13: J1.13 J3.48 U1.B48(GP_Out_S13)
NetJ1_17: J1.17 J3.44 U1.B44(GP_Out_S12)
NetJ1_21: J1.21 J3.40 U1.B40(GP_Out_S11)
NetJ1_25: J1.25 J3.36 U1.B36(GP_Out_S10)
NetJ1_29: J1.29 J3.32 U1.B32(GP_Out_S9)
NetJ1_32: J1.32 J3.29 U1.B29(NegLimtCom)
NetJ1_33: J1.33 J3.28 U1.B28(GP_Out_S8)
NetJ1_37: J1.37 J3.24 U1.B24(GP_Out_S7)
NetJ1_41: J1.41 J3.20 U1.B20(GP_Out_S6)
NetJ1_42: J1.42 J3.19 U1.B19(PosLimtCom)
NetJ1_45: J1.45 J3.16 U1.B16(GP_Out_S5)
NetJ1_49: J1.49 J3.12 U1.B12(GP_Out_S4)
NetJ1_52: J1.52 J3.9 U1.B9(HomeCom)
NetJ1_53: J1.53 J3.8 U1.B8(GP_Out_S3)
NetJ1_57: J1.57 J3.4 U1.B4(GP_Out_S2)
NetJ2_2: J2.2 J5.60 U1.A2(DAC_Out0)
NetJ2_4: J2.4 J5.58 U1.A4(DAC_Out1)
NetJ2_6: J2.6 J5.56 U1.A6(DAC_Out2)
NetJ2_7: J2.7 J5.53 U1.A7(Analog_In7)
NetJ2_8: J2.8 J5.54 U1.A8(DAC_Out3)
NetJ2_9: J2.9 J5.51 U1.A9(Analog_In6)
NetJ2_10: J2.10 J5.52 U1.A10(DAC_Out4)
NetJ2_11: J2.11 J5.49 U1.A11(Analog_In5)
NetJ2_12: J2.12 J5.50 U1.A12(DAC_Out5)
NetJ2_13: J2.13 J5.47 U1.A13(Analog_In4)
NetJ2_14: J2.14 J5.48 U1.A14(DAC_Out6)
NetJ2_15: J2.15 J5.45 U1.A15(Analog_In3)
NetJ2_16: J2.16 J5.46 U1.A16(DAC_Out7)
NetJ2_17: J2.17 J5.43 U1.A17(Analog_In2)
NetJ2_18: J2.18 J5.44 R1.1 U1.A18(QuadA1+)
NetJ2_19: J2.19 J5.41 U1.A19(Analog_In1)
NetJ2_21: J2.21 J5.39 U1.A21(Analog_In0)
NetJ2_22: J2.22 J5.40 R2.1 U1.A22(QuadB1+)
NetJ2_23: J2.23 J5.37 U1.A23(Analog_In11)
NetJ2_25: J2.25 J5.35 U1.A25(Analog_In10)
NetJ2_26: J2.26 J5.36 R3.1 U1.A26(Index1+)
NetJ2_27: J2.27 J5.33 U1.A27(Analog_In9)
NetJ2_29: J2.29 J5.31 U1.A29(Analog_In8)
NetJ2_30: J2.30 J5.32 R4.1 U1.A30(QuadA2+)
NetJ2_31: J2.31 J5.29 U1.A31(USB_VBUS)
NetJ2_33: J2.33 J5.27 U1.A33(USB_D-)
NetJ2_34: J2.34 J5.28 R5.1 U1.A34(QuadB2+)
NetJ2_35: J2.35 J5.25 U1.A35(USB_D+)
NetJ2_37: J2.37 J5.23 U1.A37(Analog_In12)
NetJ2_38: J2.38 J5.24 R6.1 U1.A38(Index2+)
NetJ2_39: J2.39 J5.21 U1.A39(Analog_In13)
NetJ2_41: J2.41 J5.19 U1.A41(Analog_In14)
NetJ2_42: J2.42 J5.20 R7.1 U1.A42(QuadA3+)
NetJ2_43: J2.43 J5.17 U1.A43(Analog_In15)
NetJ2_45: J2.45 J5.15 U1.A45(nTRST)
NetJ2_46: J2.46 J5.16 R8.1 U1.A46(QuadB3+)
NetJ2_47: J2.47 J5.13 U1.A47(nEMU)
NetJ2_49: J2.49 J5.11 U1.A49(TDI)
NetJ2_50: J2.50 J5.12 R9.1 U1.A50(Index3+)
NetJ2_51: J2.51 J5.9 U1.A51(TMS)
NetJ2_53: J2.53 J5.7 U1.A53(TDO)
NetJ2_54: J2.54 J5.8 R10.1 U1.A54(QuadA4+)
NetJ2_55: J2.55 J5.5 U1.A55(TCK)
NetJ2_57: J2.57 J5.3 U1.A57(RS485_H)
NetJ2_58: J2.58 J5.4 R11.1 U1.A58(QuadB4+)
NetJ2_59: J2.59 J5.1 U1.A59(RS485_L)
NetJ2_61: J2.61 J6.2 U1.A61(SPI_SClk)
NetJ2_62: J2.62 J6.1 R12.1 U1.A62(Index4+)
NetJ2_63: J2.63 J6.4 U1.A63(SPI_MOSI)
NetJ2_65: J2.65 J6.6 U1.A65(SPI_MISO)
NetJ2_66: J2.66 J6.5 U1.A66(VA25)
NetJ2_67: J2.67 J6.8 U1.A67(SPI_SS)
NetJ2_68: J2.68 J6.7 U1.A68(EtherTx-)
NetJ2_69: J2.69 J6.10 U1.A69(SPI_SSEL1)
NetJ2_70: J2.70 J6.9 U1.A70(EtherTx+)
NetJ2_71: J2.71 J6.12 R13.1 U1.A71(GP_I/Ospare0)
NetJ2_72: J2.72 J6.11 U1.A72(TDO-App_TDI)
NetJ2_73: J2.73 J6.14 R14.1 U1.A73(GP_I/Ospare1)
NetJ2_74: J2.74 J6.13 U1.A74(BF-FPGA_TDO)
NetJ2_75: J2.75 J6.16 R15.1 U1.A75(GP_I/Ospare2)
NetJ2_76: J2.76 J6.15 U1.A76(FPGA_TMS)
NetJ2_77: J2.77 J6.18 R16.1 U1.A77(GP_I/Ospare3)
NetJ2_78: J2.78 J6.17 U1.A78(FPGA_TCK)
NetJ2_79: J2.79 J6.20 R17.1 U1.A79(GP_I/Ospare4)
NetJ2_81: J2.81 J6.22 R18.1 U1.A81(GP_I/Ospare5)
NetJ2_82: J2.82 J6.21 U1.A82(Opto_Out_E0)
NetJ2_83: J2.83 J6.24 R19.1 U1.A83(GP_I/Ospare6)
NetJ2_85: J2.85 J6.26 R20.1 U1.A85(GP_I/Ospare7)
NetJ2_86: J2.86 J6.25 U1.A86(Opto_Out_E1)
NetJ2_87: J2.87 J6.28 R21.1 U1.A87(GP_I/Ospare8)
NetJ2_89: J2.89 J6.30 R22.1 U1.A89(GP_I/Ospare9)
NetJ2_90: J2.90 J6.29 U1.A90(Opto_Out_E2)
NetJ2_91: J2.91 J6.32 R23.1 U1.A91(GP_I/Ospare10)
NetJ2_93: J2.93 J6.34 R24.1 U1.A93(GP_I/Ospare11)
NetJ2_94: J2.94 J6.33 U1.A94(Opto_Out_E3)
NetJ2_95: J2.95 J6.36 R25.1 U1.A95(GP_I/Ospare12)
NetJ2_97: J2.97 J6.38 R26.1 U1.A97(GP_I/Ospare13)
NetJ2_98: J2.98 J6.37 U1.A98(Opto_Out_E4)
NetJ2_99: J2.99 J6.40 R27.1 U1.A99(GP_I/Ospare14)
NetJ2_101: J2.101 J6.42 R28.1 U1.A101(GP_I/Ospare15)
NetJ2_102: J2.102 J6.41 U1.A102(Opto_Out_E5)
NetJ2_103: J2.103 J6.44 U1.A103(EtherLED_Act)
NetJ2_105: J2.105 J6.46 U1.A105(EtherLED_FD)
NetJ2_106: J2.106 J6.45 U1.A106(Opto_Out_E6)
NetJ2_107: J2.107 J6.48 U1.A107(EtherLED100Mbps)
NetJ2_109: J2.109 J6.50 U1.A109(I2C_SDA)
NetJ2_110: J2.110 J6.49 U1.A110(Opto_Out_E7)
NetJ2_111: J2.111 J6.52 U1.A111(I2C_SCL)
NetJ2_112: J2.112 J6.51 U1.A112(Opto_Input_Com6)
NetJ2_113: J2.113 J6.54 U1.A113(CANnode0)
NetJ2_115: J2.115 J6.56 U1.A115(CANnode1)
NetJ2_117: J2.117 J6.58 U1.A117(CAN_H)
NetJ2_119: J2.119 J6.60 U1.A119(CAN_L)
NetJ3_64: J3.64 J4.4 U1.B64(GP_Out_S17)
NetJ3_65: J3.65 J4.5 U1.B65(EtherRx-)
NetJ3_67: J3.67 J4.7 U1.B67(EtherRx+)
NetJ3_68: J3.68 J4.8 U1.B68(GP_Out_S18)
NetJ3_69: J3.69 J4.9 U1.B69(EtherGND)
NetJ3_71: J3.71 J4.11 U1.B71(Opto_Input_Com1)
NetJ3_72: J3.72 J4.12 U1.B72(GP_Out_S19)
NetJ3_76: J3.76 J4.16 U1.B76(GP_Out_S20)
NetJ3_80: J3.80 J4.20 U1.B80(GP_Out_S21)
NetJ3_81: J3.81 J4.21 U1.B81(Opto_Input_Com2)
NetJ3_84: J3.84 J4.24 U1.B84(GP_Out_S22)
NetJ3_88: J3.88 J4.28 U1.B88(GP_Out_S23)
NetJ3_91: J3.91 J4.31 U1.B91(Opto_Input_Com3)
NetJ3_92: J3.92 J4.32 U1.B92(GP_Out_S24)
NetJ3_96: J3.96 J4.36 U1.B96(GP_Out_S25)
NetJ3_100: J3.100 J4.40 U1.B100(GP_Out_S26)
NetJ3_101: J3.101 J4.41 U1.B101(Opto_Input_Com4)
NetJ3_104: J3.104 J4.44 U1.B104(GP_Out_S27)
NetJ3_108: J3.108 J4.48 U1.B108(GP_Out_S28)
NetJ3_111: J3.111 J4.51 U1.B111(Opto_Input_Com5)
NetJ3_112: J3.112 J4.52 U1.B112(GP_Out_S29)
NetJ3_116: J3.116 J4.56 U1.B116(GP_Out_S30)
NetJ3_120: J3.120 J4.60 U1.B120(GP_Out_S31)

### Library data of the parts
D1-D156 = LED SMD 0402: RED LED, 0402 SMD; Manufacturer: Rohm; Manuf p/n: SML-P11UTT86; LCO p/n: 140-00013; Vendor: DigiKey; Vendor Mult.: 1; Vendor p/n: 511-1653-1-ND
J1 J4-J6 = HDR 2x30   0.1": Manufacturer: FCI; Manuf p/n: 67997-472HLF; LCO p/n: 125-00124; VALUE: 2x36; Vendor: Digi-Key; Vendor p/n: 609-2221-ND
J2 J3 = QSH-060-01-X-D-A: LCO p/n: 125-00125; Manufacturer: SAMTEC; Manuf p/n: QSH-060-01-X-D-A; VALUE: QSH-060-01-X-D-A; Vendor: SAMTEC
J7 = Header 7X2: Header, 7-Pin, Dual row; Manufacturer: Molex/Waldom; Vendor: DIGIKEY; Vendor Mult.: 1; LCO p/n: 125-00005; Value: HEADER 7X2
R1-R28 = Res SMD: Resistor 0805; Manufacturer: Vishay/Dale; Manuf p/n: CRCW0805301FKEA; Vendor: DIGIKEY; Vendor p/n: 541-301CCT-ND; Vendor Mult.: 10; LCO p/n: 181-03010; COST: 0.09
TP1-TP10 = Test point: Manufacturer: Keystone; Manuf p/n: 1249; Vendor: Bisco Ind.; LCO p/n: 125-00013; Vendor p/n: 1249; COST: 0.18; VALUE: Test point
U1 = SuperFin Module: LCO p/n: 830-00010

## Sheet Sheet1.SchDoc
size B; PageSetup: Record=PageOptions|CenterHorizontal=True|CenterVertical=True|PrintScale=1.12|XCorrection=1.00|YCorrection=1.00|PrintKind=0|BorderSize=5000000|LeftOffset=0|BottomOffset=0|Orientation=2|PaperLength=1000|PaperWidth=1000|Scale=100|PaperSource=7|PrintQuality=-4|MediaType=1|DitherType=10|PaperKind=Tabloid|PrintScaleMode=1
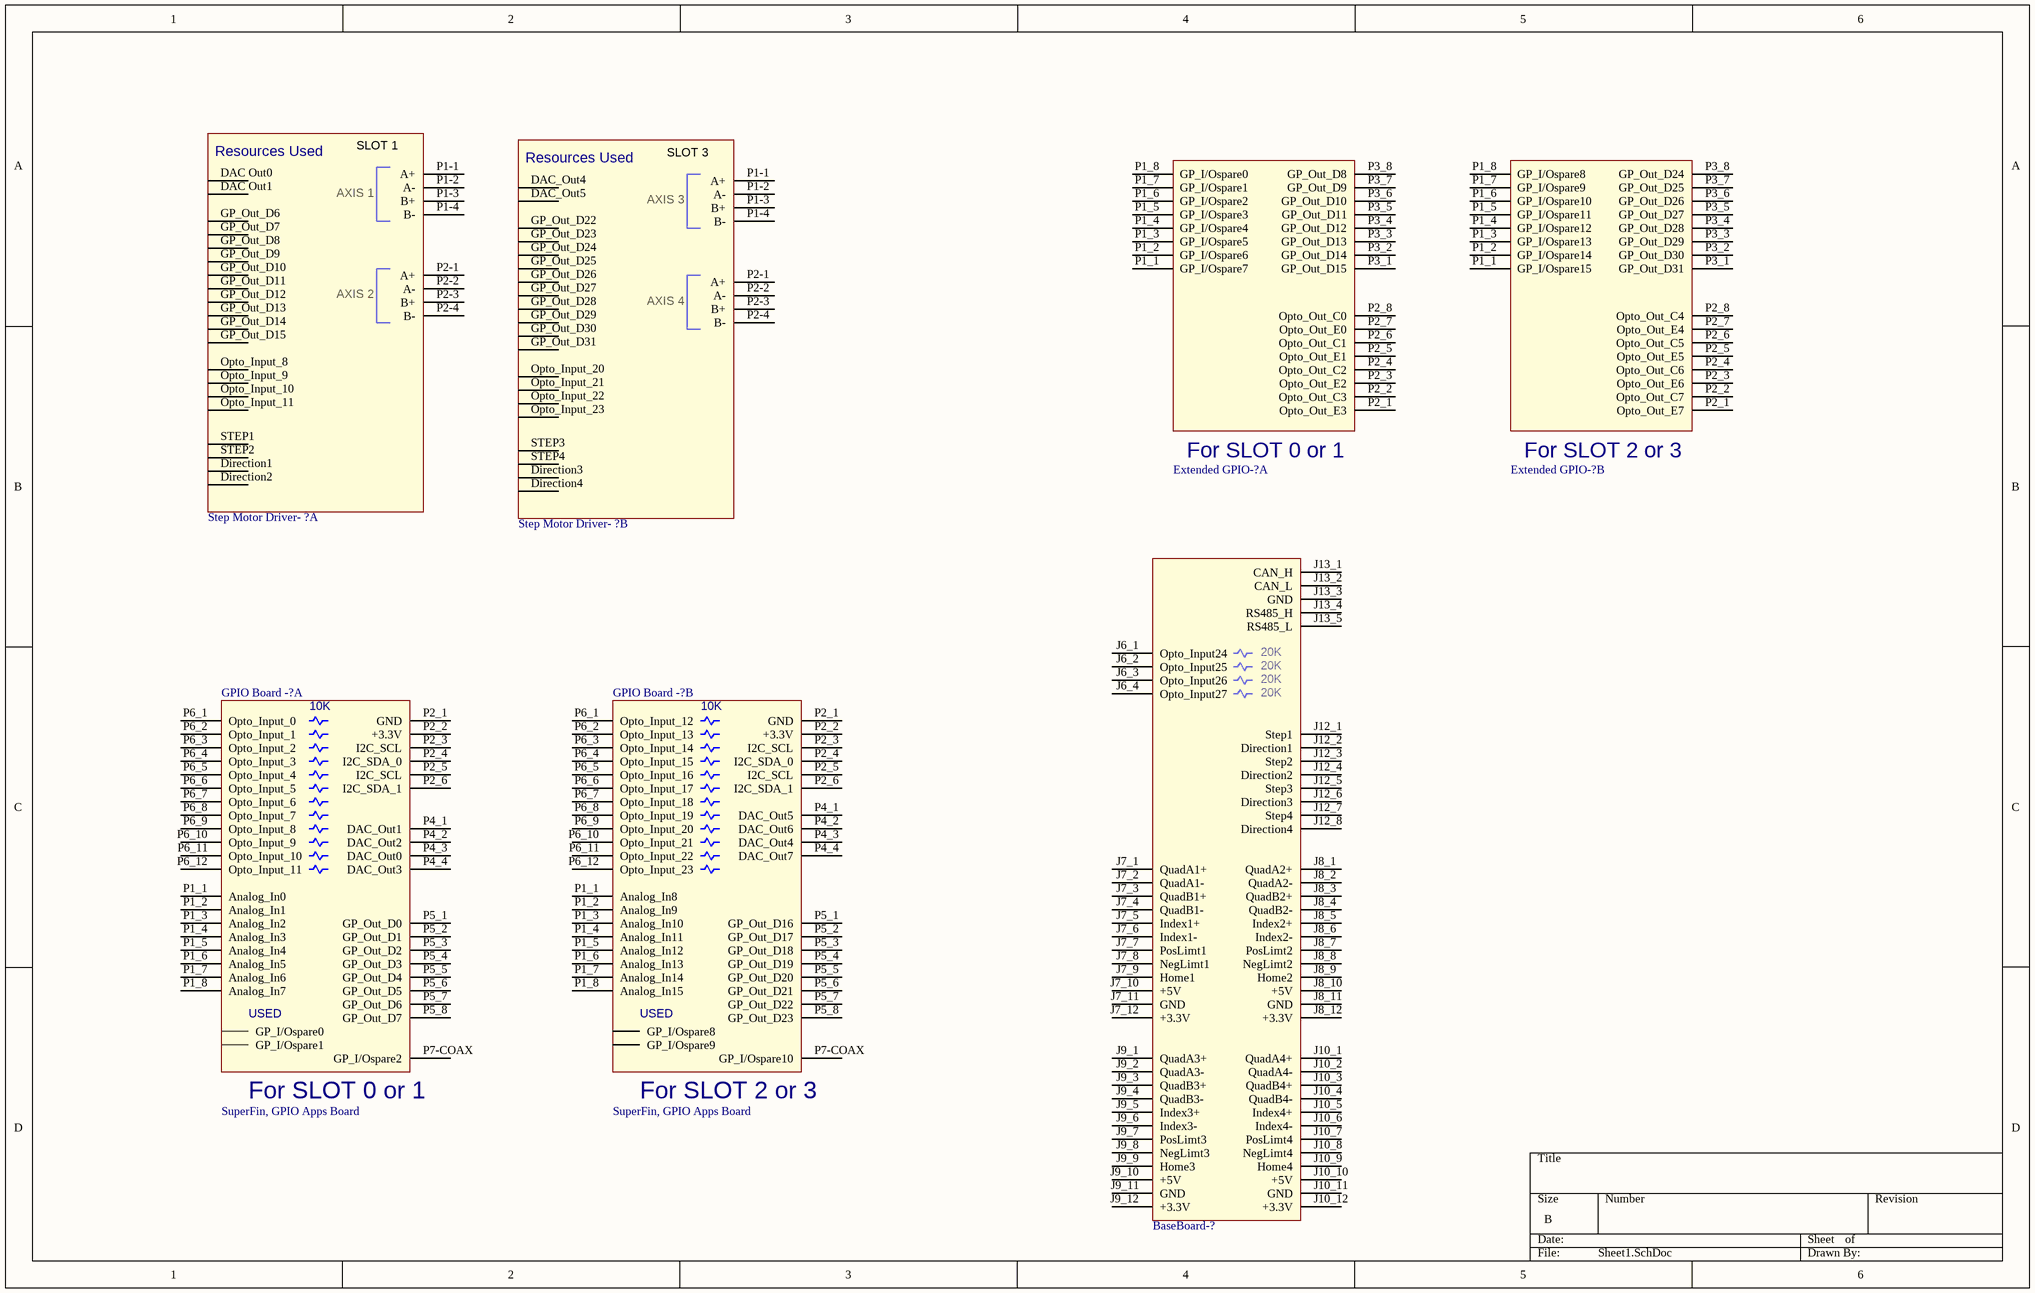
[diagram p2: Sheet1.SchDoc]

### Parts
(Parts that share a designator on the sheet are numbered #1, #2 ... from top to bottom, then left to right.)
BaseBoard-?  SuperFin BaseBoard  (value not drawn)
Extended_GPIO-?#1  SuperFin, Extended GPIO Apps Board  (value not drawn)  (part A of 2)
Extended_GPIO-?#2  SuperFin, Extended GPIO Apps Board  (value not drawn)  (part B of 2)
GPIO_Board_-?#1  SuperFin, GPIO Apps Board  (part A of 2)
GPIO_Board_-?#2  SuperFin, GPIO Apps Board  (part B of 2)
Step_Motor_Driver-_?#1  SuperFin, 2 Axis Step Motor Driver  (value not drawn)  (part A of 2)
Step_Motor_Driver-_?#2  SuperFin, 2 Axis Step Motor Driver  (value not drawn)  (part B of 2)

### Nets

Not connected (* = marked no-connect by the designer): BaseBoard-? J6_1(Opto_Input24) J6_2(Opto_Input25) J6_3(Opto_Input26) J6_4(Opto_Input27) J7_1(QuadA1+) J7_2(QuadA1-) J7_3(QuadB1+) J7_4(QuadB1-) J7_5(Index1+) J7_6(Index1-) J7_7(PosLimt1) J7_8(NegLimt1) J7_9(Home1) J7_10(+5V) J7_11(GND) J7_12(+3.3V) J8_1(QuadA2+) J8_2(QuadA2-) J8_3(QuadB2+) J8_4(QuadB2-) J8_5(Index2+) J8_6(Index2-) J8_7(PosLimt2) J8_8(NegLimt2) J8_9(Home2) J8_10(+5V) J8_11(GND) J8_12(+3.3V) J9_1(QuadA3+) J9_2(QuadA3-) J9_3(QuadB3+) J9_4(QuadB3-) J9_5(Index3+) J9_6(Index3-) J9_7(PosLimt3) J9_8(NegLimt3) J9_9(Home3) J9_10(+5V) J9_11(GND) J9_12(+3.3V) J10_1(QuadA4+) J10_2(QuadA4-) J10_3(QuadB4+) J10_4(QuadB4-) J10_5(Index4+) J10_6(Index4-) J10_7(PosLimt4) J10_8(NegLimt4) J10_9(Home4) J10_10(+5V) J10_11(GND) J10_12(+3.3V) J12_1(Step1) J12_2(Direction1) J12_3(Step2) J12_4(Direction2) J12_5(Step3) J12_6(Direction3) J12_7(Step4) J12_8(Direction4) J13_1(CAN_H) J13_2(CAN_L) J13_3(GND) J13_4(RS485_H) J13_5(RS485_L); Extended_GPIO-?#1 P1_1(GP_I/Ospare7) P1_2(GP_I/Ospare6) P1_3(GP_I/Ospare5) P1_4(GP_I/Ospare4) P1_5(GP_I/Ospare3) P1_6(GP_I/Ospare2) P1_7(GP_I/Ospare1) P1_8(GP_I/Ospare0) P2_1(Opto_Out_E3) P2_2(Opto_Out_C3) P2_3(Opto_Out_E2) P2_4(Opto_Out_C2) P2_5(Opto_Out_E1) P2_6(Opto_Out_C1) P2_7(Opto_Out_E0) P2_8(Opto_Out_C0) P3_1(GP_Out_D15) P3_2(GP_Out_D14) P3_3(GP_Out_D13) P3_4(GP_Out_D12) P3_5(GP_Out_D11) P3_6(GP_Out_D10) P3_7(GP_Out_D9) P3_8(GP_Out_D8); Extended_GPIO-?#2 P1_1(GP_I/Ospare15) P1_2(GP_I/Ospare14) P1_3(GP_I/Ospare13) P1_4(GP_I/Ospare12) P1_5(GP_I/Ospare11) P1_6(GP_I/Ospare10) P1_7(GP_I/Ospare9) P1_8(GP_I/Ospare8) P2_1(Opto_Out_E7) P2_2(Opto_Out_C7) P2_3(Opto_Out_E6) P2_4(Opto_Out_C6) P2_5(Opto_Out_E5) P2_6(Opto_Out_C5) P2_7(Opto_Out_E4) P2_8(Opto_Out_C4) P3_1(GP_Out_D31) P3_2(GP_Out_D30) P3_3(GP_Out_D29) P3_4(GP_Out_D28) P3_5(GP_Out_D27) P3_6(GP_Out_D26) P3_7(GP_Out_D25) P3_8(GP_Out_D24); GPIO_Board_-?#1 0(GP_I/Ospare1) P1_1(Analog_In0) P1_2(Analog_In1) P1_3(Analog_In2) P1_4(Analog_In3) P1_5(Analog_In4) P1_6(Analog_In5) P1_7(Analog_In6) P1_8(Analog_In7) P2_1(GND) P2_2(+3.3V) P2_3(I2C_SCL) P2_4(I2C_SDA_0) P2_5(I2C_SCL) P2_6(I2C_SDA_1) P4_1(DAC_Out1) P4_2(DAC_Out2) P4_3(DAC_Out0) P4_4(DAC_Out3) P5_1(GP_Out_D0) P5_2(GP_Out_D1) P5_3(GP_Out_D2) P5_4(GP_Out_D3) P5_5(GP_Out_D4) P5_6(GP_Out_D5) P5_7(GP_Out_D6) P5_8(GP_Out_D7) P6_1(Opto_Input_0) P6_2(Opto_Input_1) P6_3(Opto_Input_2) P6_4(Opto_Input_3) P6_5(Opto_Input_4) P6_6(Opto_Input_5) P6_7(Opto_Input_6) P6_8(Opto_Input_7) P6_9(Opto_Input_8) P6_10(Opto_Input_9) P6_11(Opto_Input_10) P6_12(Opto_Input_11) P7-COAX(GP_I/Ospare2); GPIO_Board_-?#2 0(GP_I/Ospare9) P1_1(Analog_In8) P1_2(Analog_In9) P1_3(Analog_In10) P1_4(Analog_In11) P1_5(Analog_In12) P1_6(Analog_In13) P1_7(Analog_In14) P1_8(Analog_In15) P2_1(GND) P2_2(+3.3V) P2_3(I2C_SCL) P2_4(I2C_SDA_0) P2_5(I2C_SCL) P2_6(I2C_SDA_1) P4_1(DAC_Out5) P4_2(DAC_Out6) P4_3(DAC_Out4) P4_4(DAC_Out7) P5_1(GP_Out_D16) P5_2(GP_Out_D17) P5_3(GP_Out_D18) P5_4(GP_Out_D19) P5_5(GP_Out_D20) P5_6(GP_Out_D21) P5_7(GP_Out_D22) P5_8(GP_Out_D23) P6_1(Opto_Input_12) P6_2(Opto_Input_13) P6_3(Opto_Input_14) P6_4(Opto_Input_15) P6_5(Opto_Input_16) P6_6(Opto_Input_17) P6_7(Opto_Input_18) P6_8(Opto_Input_19) P6_9(Opto_Input_20) P6_10(Opto_Input_21) P6_11(Opto_Input_22) P6_12(Opto_Input_23) P7-COAX(GP_I/Ospare10); Step_Motor_Driver-_?#1 DAC Out0 DAC Out1 Direction1 Direction2 GP_Out_D6 GP_Out_D7 GP_Out_D8 GP_Out_D9 GP_Out_D10 GP_Out_D11 GP_Out_D12 GP_Out_D13 GP_Out_D14 GP_Out_D15 Opto_Input_8 Opto_Input_9 Opto_Input_10 Opto_Input_11 P1-1(A+) P1-2(A-) P1-3(B+) P1-4(B-) P2-1(A+) P2-2(A-) P2-3(B+) P2-4(B-) STEP1 STEP2; Step_Motor_Driver-_?#2 DAC_Out4(_) DAC_Out5(_) Direction3 Direction4 GP_Out_D22 GP_Out_D23 GP_Out_D24 GP_Out_D25 GP_Out_D26 GP_Out_D27 GP_Out_D28 GP_Out_D29 GP_Out_D30 GP_Out_D31 Opto_Input_20 Opto_Input_21 Opto_Input_22 Opto_Input_23 P1-1(A+) P1-2(A-) P1-3(B+) P1-4(B-) P2-1(A+) P2-2(A-) P2-3(B+) P2-4(B-) STEP3 STEP4

### Notes on the sheet
- (in symbol SuperFin BaseBoard) 20K
- (in symbol SuperFin, 2 Axis Step Motor Driver, part A) SLOT 1; Resources Used; AXIS 1; AXIS 2
- (in symbol SuperFin, 2 Axis Step Motor Driver, part B) SLOT 3; Resources Used; AXIS 3; AXIS 4
- (in symbol SuperFin, Extended GPIO Apps Board, part A) For SLOT 0 or 1
- (in symbol SuperFin, Extended GPIO Apps Board, part B) For SLOT 2 or 3
- (in symbol SuperFin, GPIO Apps Board, part A) 10K; USED; For SLOT 0 or 1
- (in symbol SuperFin, GPIO Apps Board, part B) 10K; USED; For SLOT 2 or 3